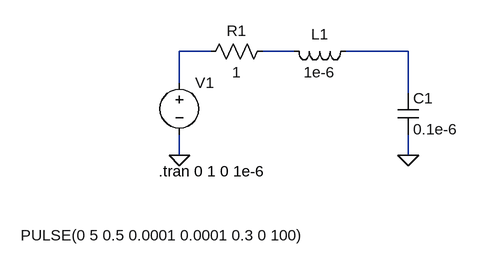
[diagram p0: schematic transmission_line.asc]
transmission_line.asc, the LTspice schematic file:
Version 4
SHEET 1 880 680
WIRE -64 32 -112 32
WIRE 64 32 16 32
WIRE 240 32 144 32
WIRE -112 80 -112 32
WIRE 240 96 240 32
WIRE -112 192 -112 160
WIRE 240 192 240 160
FLAG 240 192 0
FLAG -112 192 0
SYMBOL cap 224 96 R0
SYMATTR InstName C1
SYMATTR Value 0.1e-6
SYMBOL ind 160 16 R90
WINDOW 0 5 56 VBottom 2
WINDOW 3 32 56 VTop 2
SYMATTR InstName L1
SYMATTR Value 1e-6
SYMBOL res 32 16 R90
WINDOW 0 0 56 VBottom 2
WINDOW 3 32 56 VTop 2
SYMATTR InstName R1
SYMATTR Value 1
SYMBOL voltage -112 64 R0
WINDOW 3 -244 251 Left 2
WINDOW 123 0 0 Left 0
WINDOW 39 0 0 Left 0
SYMATTR InstName V1
SYMATTR Value PULSE(0 5 0.5 0.0001 0.0001 0.3 0 100)
TEXT -144 216 Left 2 !.tran 0 1 0 1e-6

The netlist it stands for:
* transmission_line.asc
C1 N003 0 0.1e-6
L1 N003 N002 1e-6
R1 N002 N001 1
V1 N001 0 PULSE(0 5 0.5 0.0001 0.0001 0.3 0 100)
.tran 0 1 0 1e-6
.backanno
.end